# Altium project Planar_HB_1.PrjPcb
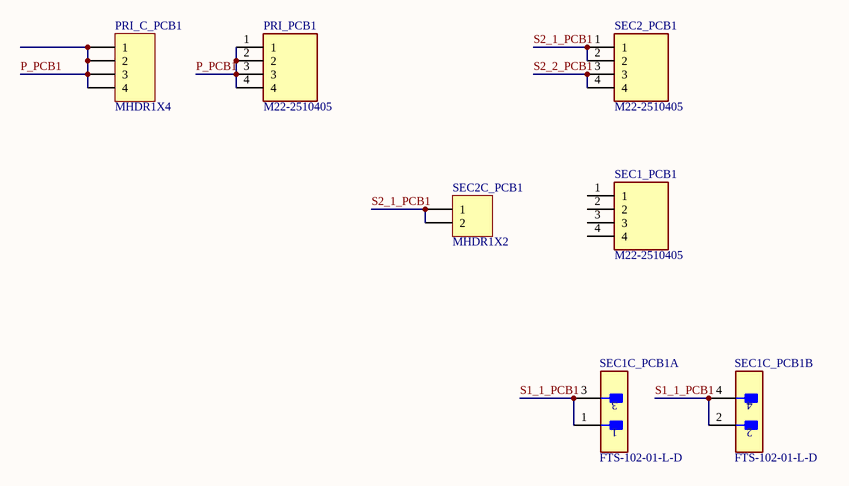
[diagram p0: Planar_HB_1.SchDoc]
1 sheet, 6 parts. Net scope: global (net labels, ports and power ports of the same name join across sheets).
Board file: Planar_HB_1.PcbDoc

## Sheet Planar_HB_1.SchDoc
size A; SheetNumber: 1; SheetTotal: 1

### Parts
PRI_C_PCB1  MHDR1X4  [MHDR1X4]
PRI_PCB1  M22-2510405  [HDRV4W50P0X200_1X4_800X200X525P]
SEC1_PCB1  M22-2510405  [HDRV4W50P0X200_1X4_800X200X525P]
SEC1C_PCB1  FTS-102-01-L-D  [FP-FTS-102-01-L-D-MFG]  (parts A,B of 2)
SEC2_PCB1  M22-2510405  [HDRV4W50P0X200_1X4_800X200X525P]
SEC2C_PCB1  MHDR1X2  [MHDR1X2]

### Nets
P_PCB1: PRI_C_PCB1.1 PRI_C_PCB1.2 PRI_C_PCB1.3 PRI_C_PCB1.4 PRI_PCB1.1 PRI_PCB1.2 PRI_PCB1.3 PRI_PCB1.4
S1_1_PCB1: SEC1C_PCB1.1 SEC1C_PCB1.2 SEC1C_PCB1.3 SEC1C_PCB1.4
S2_1_PCB1: SEC2_PCB1.1 SEC2_PCB1.2 SEC2C_PCB1.1 SEC2C_PCB1.2
S2_2_PCB1: SEC2_PCB1.3 SEC2_PCB1.4

Not connected (* = marked no-connect by the designer): SEC1_PCB1 1 2 3 4

### Library data of the parts
PRI_C_PCB1 = MHDR1X4: Header, 4-Pin; LatestRevisionDate: 17-Jul-2002; LatestRevisionNote: Re-released for DXP Platform.; Publisher: Altium Limited
PRI_PCB1 SEC1_PCB1 SEC2_PCB1 = M22-2510405: Connector; Manufacturer_Name: Harwin; Datasheet Link: https://cdn.harwin.com/pdfs/M22-251.pdf; Height: 5.25mm; Manufacturer_Part_Number: M22-2510405; Mouser Part Number: 855-M22-2510405; Mouser Price/Stock: https://www.mouser.co.uk/ProductDetail/Harwin/M22-2510405?qs=vF78I%252BjhbY9z7PsFZBZ5CA%3D%3D
SEC1C_PCB1 = CMP-02766-000107-1: CONN HEADER VERT 4POS 1.27MM; Max Current Rating: 1.75A; Row Spacing: 0.05inch; Gender: Male; Connector Type: Male Pin; Number of Positions: 4; Min Operating Temperature: -55°C; Number of Rows: 2; Color: Black; Contact Plating: Gold; Contact Mating Length: 0.12inch; Contact Material: Bronze; Radiation Hardening: No; Lead Free: Lead Free; Pitch: 1.27mm; Max Operating Temperature: 125°C; Package Quantity: 1; Housing Material: Polymer; Mount: Through Hole; Termination: Solder; Housing Color: Black; Length: 2.54mm; Packaging: Bulk; Orientation: Straight; Depth: 3.42mm; Number of Contacts: 4; REACH SVHC: No SVHC
SEC2C_PCB1 = MHDR1X2: Header, 2-Pin; LatestRevisionDate: 17-Jul-2002; LatestRevisionNote: Re-released for DXP Platform.; Publisher: Altium Limited